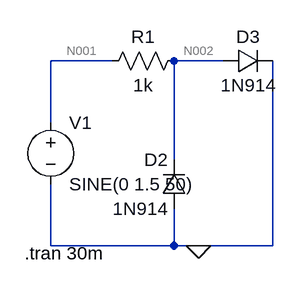
[diagram p0: schematic Draft2.asc]
Draft2.asc, the LTspice schematic file:
Version 4
SHEET 1 880 680
WIRE 112 96 32 96
WIRE 256 96 192 96
WIRE 32 176 32 96
WIRE 192 224 192 96
WIRE 32 336 32 256
WIRE 192 336 192 288
WIRE 192 336 32 336
WIRE 224 336 192 336
WIRE 320 336 320 96
WIRE 320 336 224 336
FLAG 224 336 0
SYMBOL voltage 32 160 R0
WINDOW 123 0 0 Left 2
WINDOW 39 0 0 Left 2
SYMATTR InstName V1
SYMATTR Value SINE(0 1.5 50)
SYMBOL diode 208 288 R180
WINDOW 0 24 64 Left 2
WINDOW 3 24 0 Left 2
SYMATTR InstName D2
SYMATTR Value 1N914
SYMBOL diode 256 112 R270
WINDOW 0 32 32 VTop 2
WINDOW 3 0 32 VBottom 2
SYMATTR InstName D3
SYMATTR Value 1N914
SYMBOL res 208 80 R90
WINDOW 0 0 56 VBottom 2
WINDOW 3 32 56 VTop 2
SYMATTR InstName R1
SYMATTR Value 1k
TEXT -2 346 Left 2 !.tran 30m

The netlist it stands for:
* Draft2.asc
V1 N001 0 SINE(0 1.5 50)
D2 0 N002 1N914
D3 N002 0 1N914
R1 N002 N001 1k
.model D D
.lib standard.dio
.tran 30m
.backanno
.end

* Results of the author's LTspice run, read from the files saved beside the schematic
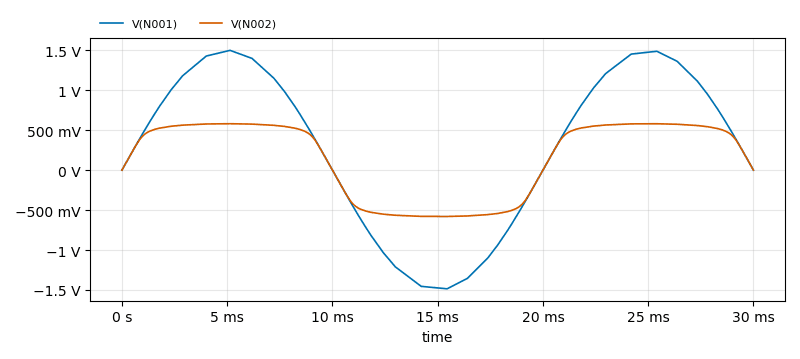
[diagram p1: Transient Analysis of Draft2.asc, plotted from the saved traces]
* Transient Analysis, 1 run:
*   V(N001): min -1.485 V, max 1.499 V, average 316.2 mV, rms 1.054 V, last 0 V
*   V(N002): min -580.2 mV, max 580.8 mV, average 161.9 mV, rms 506.7 mV, last 3.771 µV